# Altium schematic sheet Connector.SchDoc: Connectors
size A3; DrawnBy: mac; Revision: 0; Project: FotoKite; DrwanWhen: Nov.2013; CheckedWhen: When?; ProjectName: Fotokite
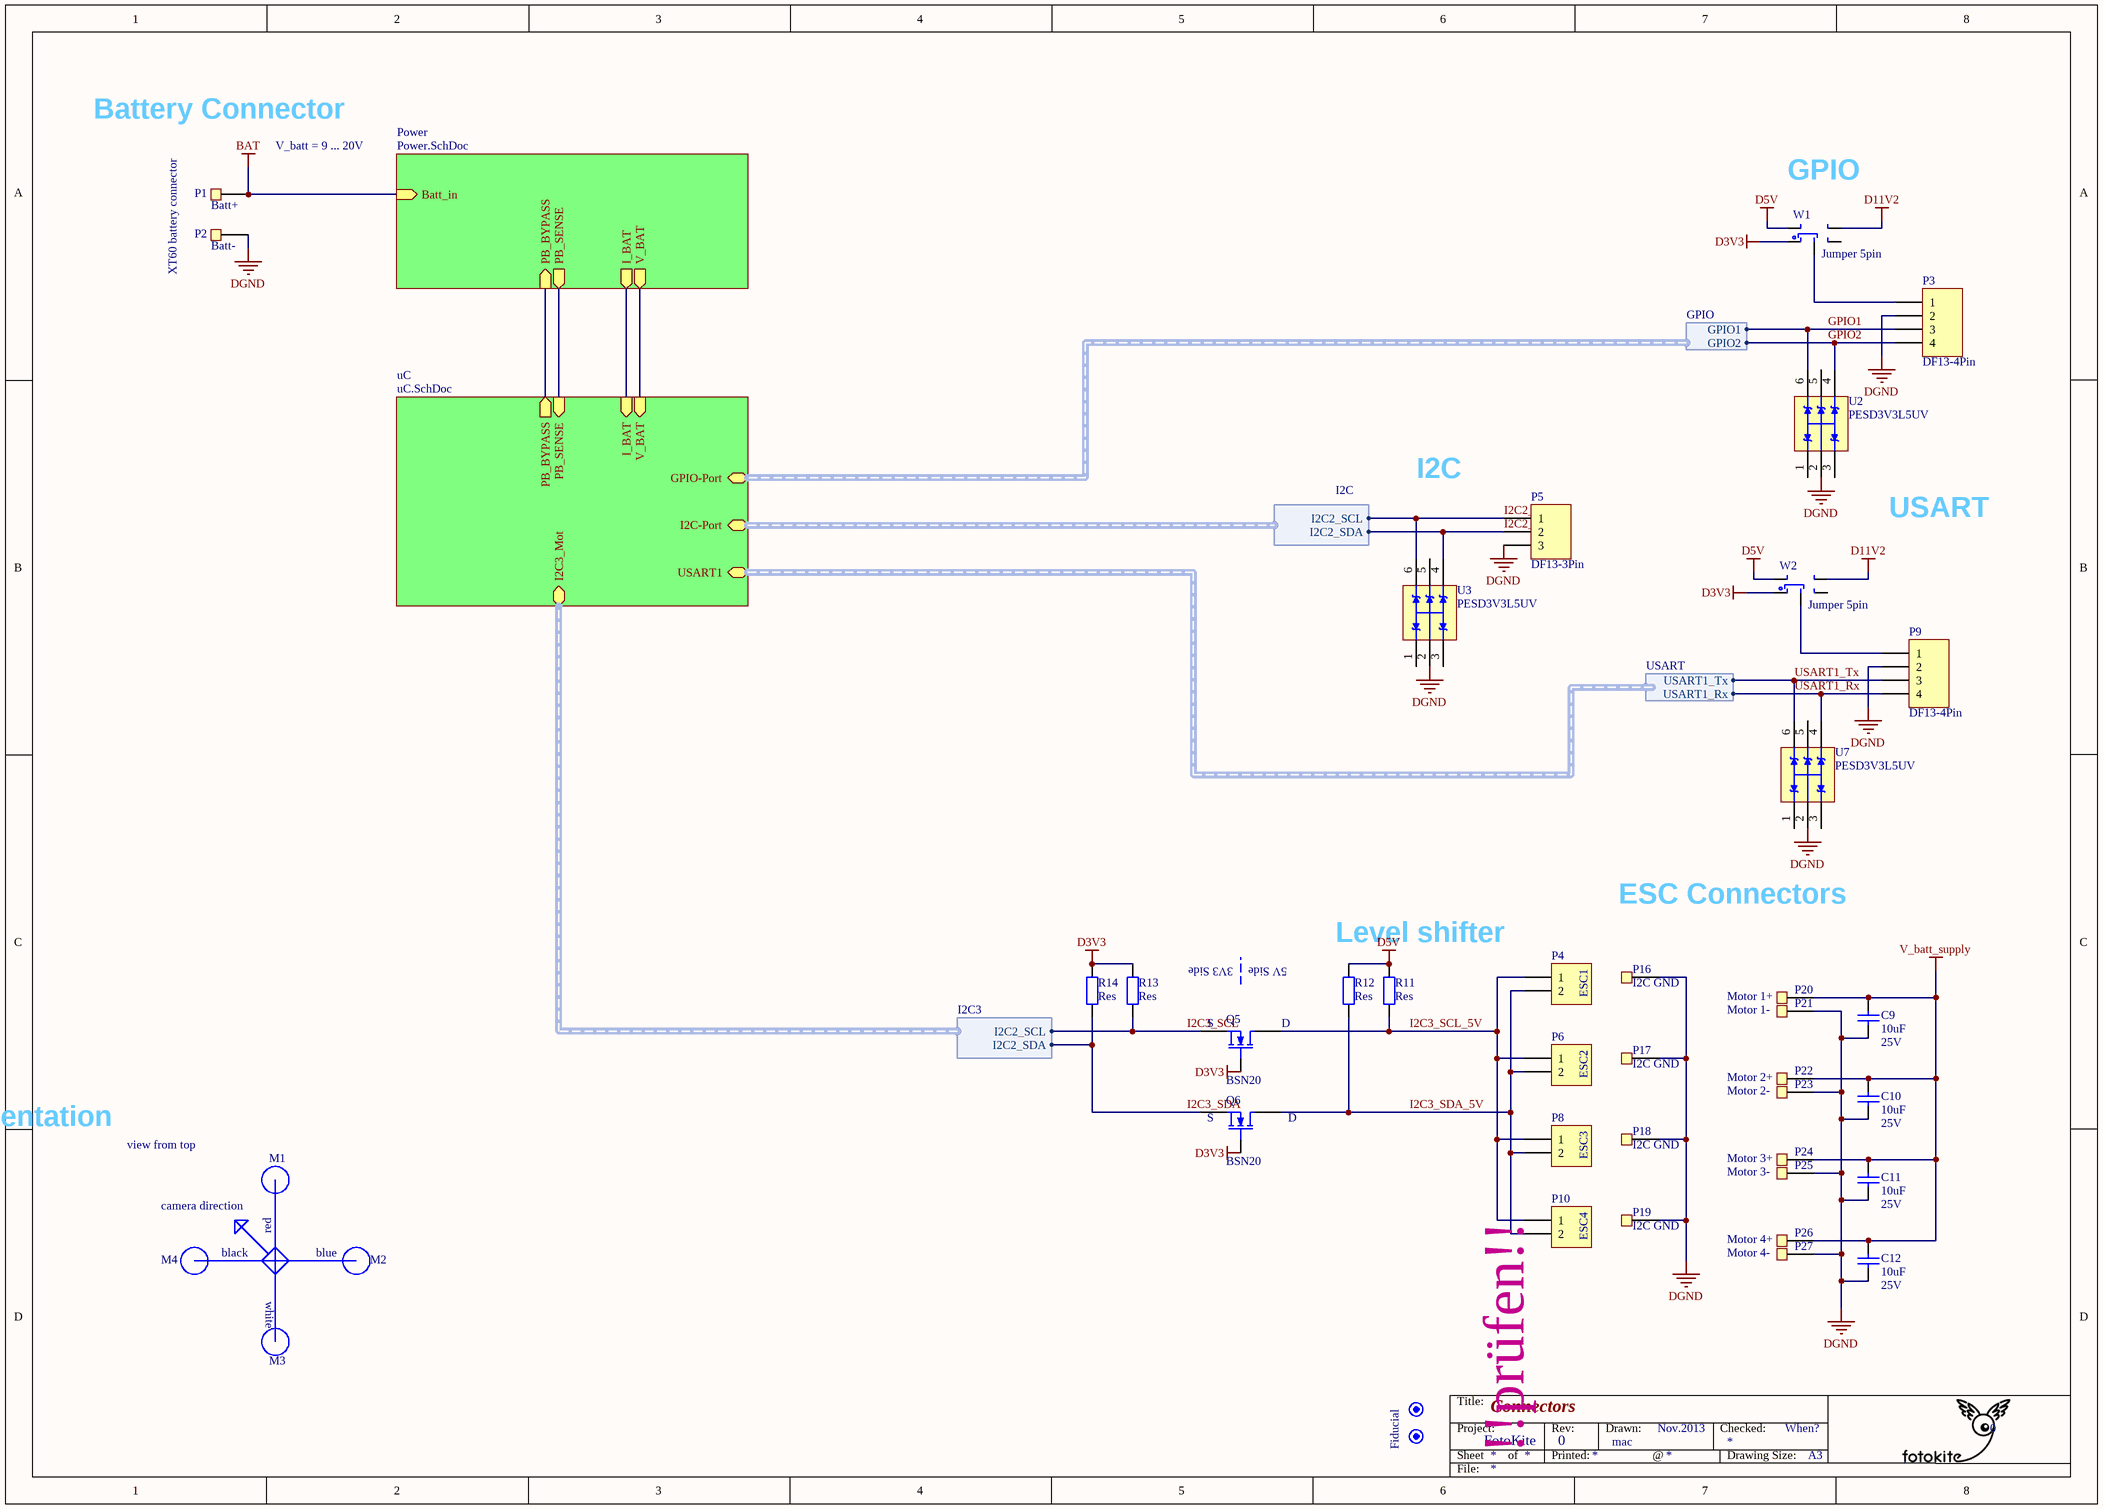
[diagram p0: Connector.SchDoc]

## Parts
C9  10uF  Note: 25V  [CAP_0805i_2012m -N]
C10  10uF  Note: 25V  [CAP_0805i_2012m -N]
C11  10uF  Note: 25V  [CAP_0805i_2012m -N]
C12  10uF  Note: 25V  [CAP_0805i_2012m -N]
FID1  Fiducial  [Fiducial 2 sides]  (value not drawn)  (no BOM)
FID2  Fiducial  [Fiducial 2 sides]  (no BOM)
P1  Batt+  [Pad_3x6mm]
P2  Batt-  [Pad_3x6mm]
P3  DF13-4Pin  [Hirose_DF13_SMT_RA_N4]
P4  ESC1  [Hirose_DF13_SMT_RA_N2]
P5  DF13-3Pin  [Hirose_DF13_SMT_RA_N3]
P6  ESC2  [Hirose_DF13_SMT_RA_N2]
P8  ESC3  [Hirose_DF13_SMT_RA_N2]
P9  DF13-4Pin  [Hirose_DF13_SMT_RA_N4]
P10  ESC4  [Hirose_DF13_SMT_RA_N2]
P16  I2C GND  [Pad_0603]
P17  I2C GND  [Pad_0603]
P18  I2C GND  [Pad_0603]
P19  I2C GND  [Pad_0603]
P20  Motor 1+  [Pad_3x4.5mm]
P21  Motor 1-  [Pad_3x4.5mm]
P22  Motor 2+  [Pad_3x4.5mm]
P23  Motor 2-  [Pad_3x4.5mm]
P24  Motor 3+  [Pad_3x4.5mm]
P25  Motor 3-  [Pad_3x4.5mm]
P26  Motor 4+  [Pad_3x4.5mm]
P27  Motor 4-  [Pad_3x4.5mm]
Q5  BSN20  [SOT23-N]
Q6  BSN20  [SOT23-N]
R11  Res  [RES_0402i_1005m -N]
R12  Res  [RES_0402i_1005m -N]
R13  Res  [RES_0402i_1005m -N]
R14  Res  [RES_0402i_1005m -N]
U2  PESD3V3L5UV  [SOT-666-N]
U3  PESD3V3L5UV  [SOT-666-N]
U7  PESD3V3L5UV  [SOT-666-N]
W1  Jumper 5pin  [J5_solder xstyle]
W2  Jumper 5pin  [J5_solder xstyle]

## Sub-sheets
Power = Power.SchDoc: Batt_in (in), I_BAT (out), PB_BYPASS (in), PB_SENSE (out), V_BAT (out)
uC = uC.SchDoc: I_BAT (in), V_BAT (in), I2C3_Mot (harness I2C3), I2C-Port (harness I2C), GPIO-Port (harness GPIO), PB_SENSE (in), PB_BYPASS (out), USART1 (harness USART)

## Harnesses
I2C3: I2C2_SCL, I2C2_SDA
I2C: I2C2_SCL, I2C2_SDA
GPIO: GPIO1, GPIO2
USART: USART1_Tx, USART1_Rx

## Nets
BAT: P1.1 ; sheet Power/Batt_in
D3V3: Q5.1(G) Q6.1(G) R13.2 R14.2 W1.1(C1) W2.1(C1)
D5V: R11.2 R12.2 W1.4(C4) W2.4(C4)
D11V2: W1.3(C3) W2.3(C3)
DGND: C9.1 C10.1 C11.1 C12.1 P2.1 P3.2 P5.3 P9.2 P16.1 P17.1 P18.1 P19.1 P21.1 P23.1 P25.1 P27.1 U2.2(a) U3.2(a) U7.2(a)
V_batt_supply: C9.2 C10.2 C11.2 C12.2 P20.1 P22.1 P24.1 P26.1
GPIO1: P3.3 U2.6(c5) ; sheet uC/GPIO-Port.GPIO1
GPIO2: P3.4 U2.4(c3) ; sheet uC/GPIO-Port.GPIO2
I2C2_SCL: P5.1 U3.6(c5) ; sheet uC/I2C-Port.I2C2_SCL
I2C2_SDA: P5.2 U3.4(c3) ; sheet uC/I2C-Port.I2C2_SDA
I2C3_SCL: Q5.2(S) R13.1 ; sheet uC/I2C3_Mot.I2C2_SCL
I2C3_SCL_5V: P4.1 P6.1 P8.1 P10.1 Q5.3(D) R11.1
I2C3_SDA: Q6.2(S) R14.1 ; sheet uC/I2C3_Mot.I2C2_SDA
I2C3_SDA_5V: P4.2 P6.2 P8.2 P10.2 Q6.3(D) R12.1
USART1_Rx: P9.3 P9.4 U7.4(c3) U7.6(c5) ; sheet uC/USART1.USART1_Tx, sheet uC/USART1.USART1_Rx  [also labelled USART1_Tx]
NetP3_1: P3.1 W1.5(C5)
NetP9_1: P9.1 W2.5(C5)
(unnamed): sheet Power/I_BAT, sheet uC/I_BAT
(unnamed): sheet Power/PB_BYPASS, sheet uC/PB_BYPASS
(unnamed): sheet Power/PB_SENSE, sheet uC/PB_SENSE
(unnamed): sheet Power/V_BAT, sheet uC/V_BAT

Not connected (* = marked no-connect by the designer): U2 1(c1) 3(c2) 5(c4); U3 1(c1) 3(c2) 5(c4); U7 1(c1) 3(c2) 5(c4); W1 2(C2); W2 2(C2)

## Notes on the sheet
- Battery Connector
- V_batt = 9 ... 20V
- (near W1) GPIO
- XT60 battery connector
- I2C
- USART
- ESC Connectors
- 3V3 Side
- 5V Side
- Level shifter
- (near Q5) S
- (near Q5) D
- Quadrocopter orientation
- (near Q6) S
- (near Q6) D
- view from top
- M1
- camera direction
- M4
- black
- red
- blue
- M2
- !!prüfen!!
- white
- M3
- 0
- Sheet
- Project:
- Title:
- of
- Rev:
- Printed:
- Drawn:
- @
- Checked:
- Drawing Size:
- A3
- File:

## Library data of the parts
C9-C12 = Cap: capacitor; Supplier: digi-key: 587-2985-1-ND
FID1 FID2 = Fiducial: Fiducial mark for automatic pcb population; note: there is a on layer and a two layer footprint!
P1 P2 = Pad: Single Pad or Testpoint
P3 P9 = DF13-4Pin: Hirose_DF13_SMT_RA_N4
P4 P6 P8 P10 = DF13-2Pin: Hirose_DF13_SMT_RA_N2; Manufacturer ID: Hirose: DF13A-2P-1.25H(50); Supplier: digikey: H3380-ND
P5 = DF13-3Pin: Hirose_DF13_SMT_RA_N4
P16-P27 = Pad: Single Pad or Testpoint; Note: kein Bauteil
Q5 Q6 = MOSFET-N: N-Channel MOSFET; Manufacturer ID: Diodes Inc: BSN20-7; Value: BSN20; Digi-Key Part No.: BSN20-7DICT-ND; Supplier: digikey: BSN20-7DICT-ND
R11-R14 = Res: Resistor
U2 U3 U7 = PESDx: ESD-protection diode array, 5ch; Manufacturer ID: NXP:  PESD3V3L5UV; Supplier: digi-key: 568-6750-2-ND
W1 W2 = Jumper 5pin: Jumper 5-pin style